# Altium schematic sheet ETH.SchDoc: ETH
size A3; Author: Silvio Navaretti; CompanyName: ARDUINO; DrawnBy: Silvio Navaretti; Engineer: Silvio Navaretti; Organization: ARDUINO; SheetNumber: 35; SheetTotal: 50; RevAuthor: Silvio Navaretti
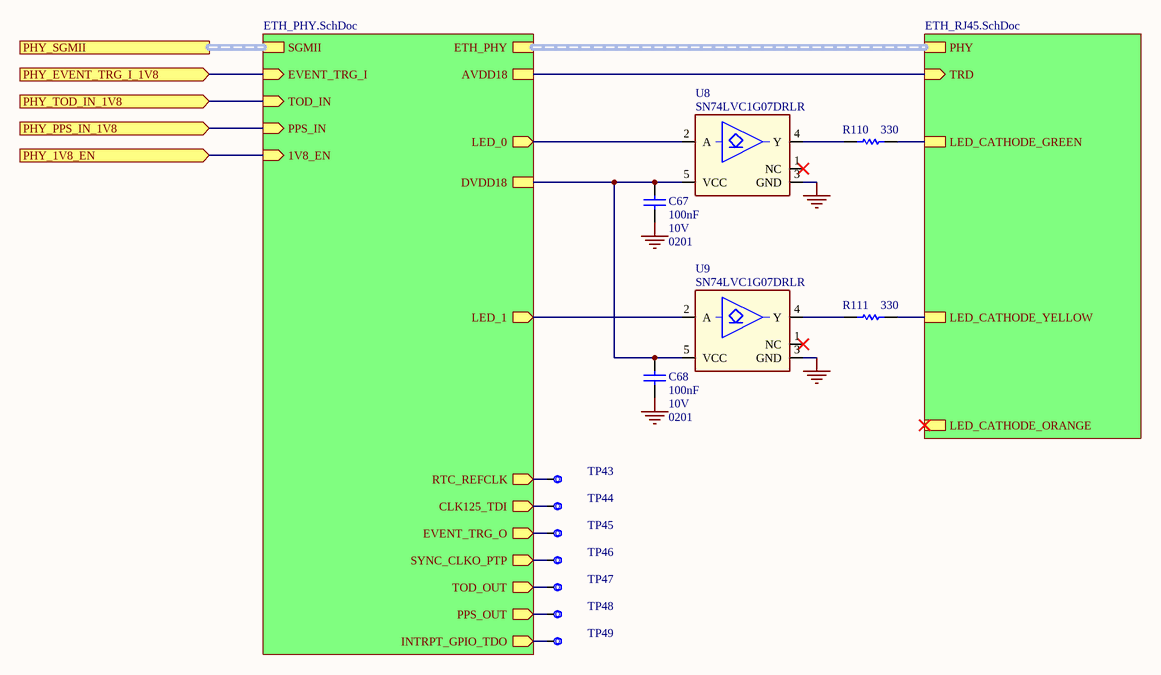
[diagram p0: ETH.SchDoc]

## Parts
C67  value 100nF  Voltage: 10V  Case Code (Imperial): 0201  [CAP-0201]  (hidden comment: CL03A104KP3NNNC)
C68  value 100nF  Voltage: 10V  Case Code (Imperial): 0201  [CAP-0201]  (hidden comment: CL03A104KP3NNNC)
R110  value 330  [RES-0201]  (hidden comment: AC0201FR-07330RL)
R111  value 330  [RES-0201]  (hidden comment: AC0201FR-07330RL)
TP43  Test point 1.00mm  [TP-1.00MM]  (value not drawn)  (no BOM)
TP44  Test point 1.00mm  [TP-1.00MM]  (value not drawn)  (no BOM)
TP45  Test point 1.00mm  [TP-1.00MM]  (value not drawn)  (no BOM)
TP46  Test point 1.00mm  [TP-1.00MM]  (value not drawn)  (no BOM)
TP47  Test point 1.00mm  [TP-1.00MM]  (value not drawn)  (no BOM)
TP48  Test point 1.00mm  [TP-1.00MM]  (value not drawn)  (no BOM)
TP49  Test point 1.00mm  [TP-1.00MM]  (value not drawn)  (no BOM)
U8  SN74LVC1G07DRLR  [TI DRL DRL0005A]
U9  SN74LVC1G07DRLR  [TI DRL DRL0005A]

## Sub-sheets
U_ETH_PHY = ETH_PHY.SchDoc: ETH_PHY (harness ETH_QCA8081), SGMII (harness SOM_MD_SGMII0), LED_0 (out), LED_1 (out), CLK125_TDI (out), EVENT_TRG_O (out), SYNC_CLKO_PTP (out), TOD_OUT (out), PPS_OUT (out), EVENT_TRG_I (in), INTRPT_GPIO_TDO (out), PPS_IN (in), RTC_REFCLK (out), TOD_IN (in), AVDD18, 1V8_EN (in), DVDD18
U_ETH_RJ45 = ETH_RJ45.SchDoc: LED_CATHODE_GREEN, LED_CATHODE_ORANGE, LED_CATHODE_YELLOW, PHY (harness ETH_QCA8081), TRD (in)

## Ports
PHY_1V8_EN (in), PHY_EVENT_TRG_I_1V8 (in), PHY_PPS_IN_1V8 (in), PHY_SGMII, PHY_TOD_IN_1V8 (in)

## Nets
GND: C67.1 C68.1 U8.3(GND) U9.3(GND)
PHY_1V8_EN: port PHY_1V8_EN, sheet U_ETH_PHY/1V8_EN
PHY_EVENT_TRG_I_1V8: port PHY_EVENT_TRG_I_1V8, sheet U_ETH_PHY/EVENT_TRG_I
PHY_PPS_IN_1V8: port PHY_PPS_IN_1V8, sheet U_ETH_PHY/PPS_IN
PHY_TOD_IN_1V8: port PHY_TOD_IN_1V8, sheet U_ETH_PHY/TOD_IN
NetC67_2: C67.2 C68.2 U8.5(VCC) U9.5(VCC) ; sheet U_ETH_PHY/DVDD18
NetR110_1: R110.1 ; sheet U_ETH_RJ45/LED_CATHODE_GREEN
NetR110_2: R110.2 U8.4(Y)
NetR111_1: R111.1 ; sheet U_ETH_RJ45/LED_CATHODE_YELLOW
NetR111_2: R111.2 U9.4(Y)
NetTP43_X: TP43.X ; sheet U_ETH_PHY/RTC_REFCLK
NetTP44_X: TP44.X ; sheet U_ETH_PHY/CLK125_TDI
NetTP45_X: TP45.X ; sheet U_ETH_PHY/EVENT_TRG_O
NetTP46_X: TP46.X ; sheet U_ETH_PHY/SYNC_CLKO_PTP
NetTP47_X: TP47.X ; sheet U_ETH_PHY/TOD_OUT
NetTP48_X: TP48.X ; sheet U_ETH_PHY/PPS_OUT
NetTP49_X: TP49.X ; sheet U_ETH_PHY/INTRPT_GPIO_TDO
NetU8_2: U8.2(A) ; sheet U_ETH_PHY/LED_0
NetU9_2: U9.2(A) ; sheet U_ETH_PHY/LED_1
(unnamed): sheet U_ETH_PHY/AVDD18, sheet U_ETH_RJ45/TRD

Not connected (* = marked no-connect by the designer): U8 1(NC)*; U9 1(NC)*

## Buses and harness runs
harness port PHY_SGMII = sheet U_ETH_PHY/SGMII
harness sheet U_ETH_PHY/ETH_PHY = sheet U_ETH_RJ45/PHY

## Notes on the sheet
- Title:
- ID:
- Date:
- Time:
- Version:
- Sheet
- of
- RevAuthor:
- Reference Designs ARE PROVIDED "AS IS" AND "WITH ALL FAULTS. Arduino SA DISCLAIMS ALL OTHER WARRANTIES, EXPRESS OR IMPLIED, REGARDING PRODUCTS, INCLUDING BUT NOT LIMITED TO, ANY IMPLIED WARRANTIES OF MERCHANTABILITY OR FITNESS FOR A PARTICULAR PURPOSE.
  Arduino SA may make changes to specifications and product descriptions at any time, without notice. The Customer must not rely on the absence or characteristics of any features or instructions marked "reserved" or "undefined".
  Arduino SA reserves these for future definition and shall have no responsibility whatsoever for conflicts or incompatibilities arising from future changes to them. The product information on the Web Site or Materials is subject to change without notice.
  Do not finalize a design with this info. ARDUINO and other Arduino brands and logos and Trademarks of Arduino SA. All Arduino SA Trademarks cannot be used without owner's formal permission.
- File:
- Author:

## Library data of the parts
C67 C68 = C0113-A.6: CAP CHIP 0201 100nF 10% 10V X5R; Manufacturer: Samsung Electro-Mechanics; Code Arduino: C0113; Technology: Ceramic; Part Number: CL03A104KP3NNNC; Dielectric: X5R; Tolerance: 10%
R110 R111 = R0149-A.21: RES CHIP 0201 330R 1% 1/20W; Manufacturer: Yageo; Code Arduino: R0149; Power: 50mW; Temperature coefficient: 200ppm; Case Code (Imperial): 0201; Technology: Thick film; Part Number: AC0201FR-07330RL; Manufacturer 2: Samsung Electro-Mechanics; Tolerance: 1%
TP43-TP49 = UT0013-A.6: Part Number: This is not a component; Design Item ID: CMP-018-0005-A.3; Source: ut.SchLib; Manufacturer: This is not a component; Code Arduino: This is not a component; Pin Count: 1
U8 U9 = U0494-A.2: IC buffer open drain, 1.65V to 5.5V, 32mA sink current, SOT-5X3 1.6mmx1.6mm; Manufacturer: Texas Instruments; Code Arduino: U0494; Part Number: SN74LVC1G07DRLR